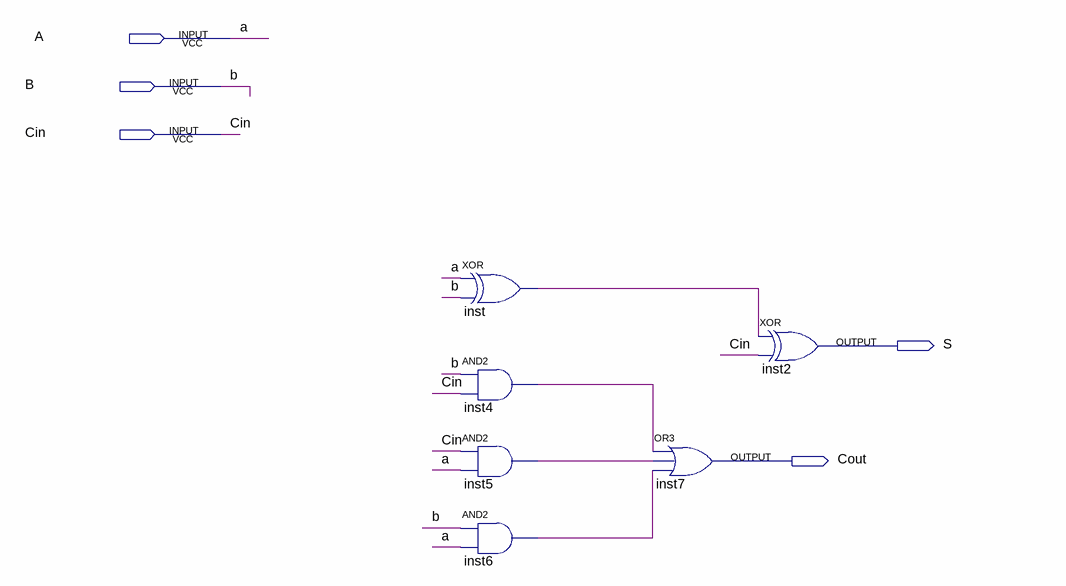
[diagram p0: schematic sheet]
// Quartus schematic somadorcompleto1bit.bdf as structural Verilog: 6 symbols, 5 pins
module somadorcompleto1bit (
  input  A,
  input  B,
  input  Cin,
  output S,
  output Cout
);

  wire inst4_out, inst5_out, inst6_out, inst_out;

  xor inst (inst_out, A, B);
  and inst4 (inst4_out, B, Cin);
  and inst5 (inst5_out, Cin, A);
  and inst6 (inst6_out, B, A);
  or inst7 (Cout, inst4_out, inst5_out, inst6_out);
  xor inst2 (S, inst_out, Cin);
endmodule
